# EAGLE design VCF-LP-BP-HP_v4 (EAGLE 9.5.2)
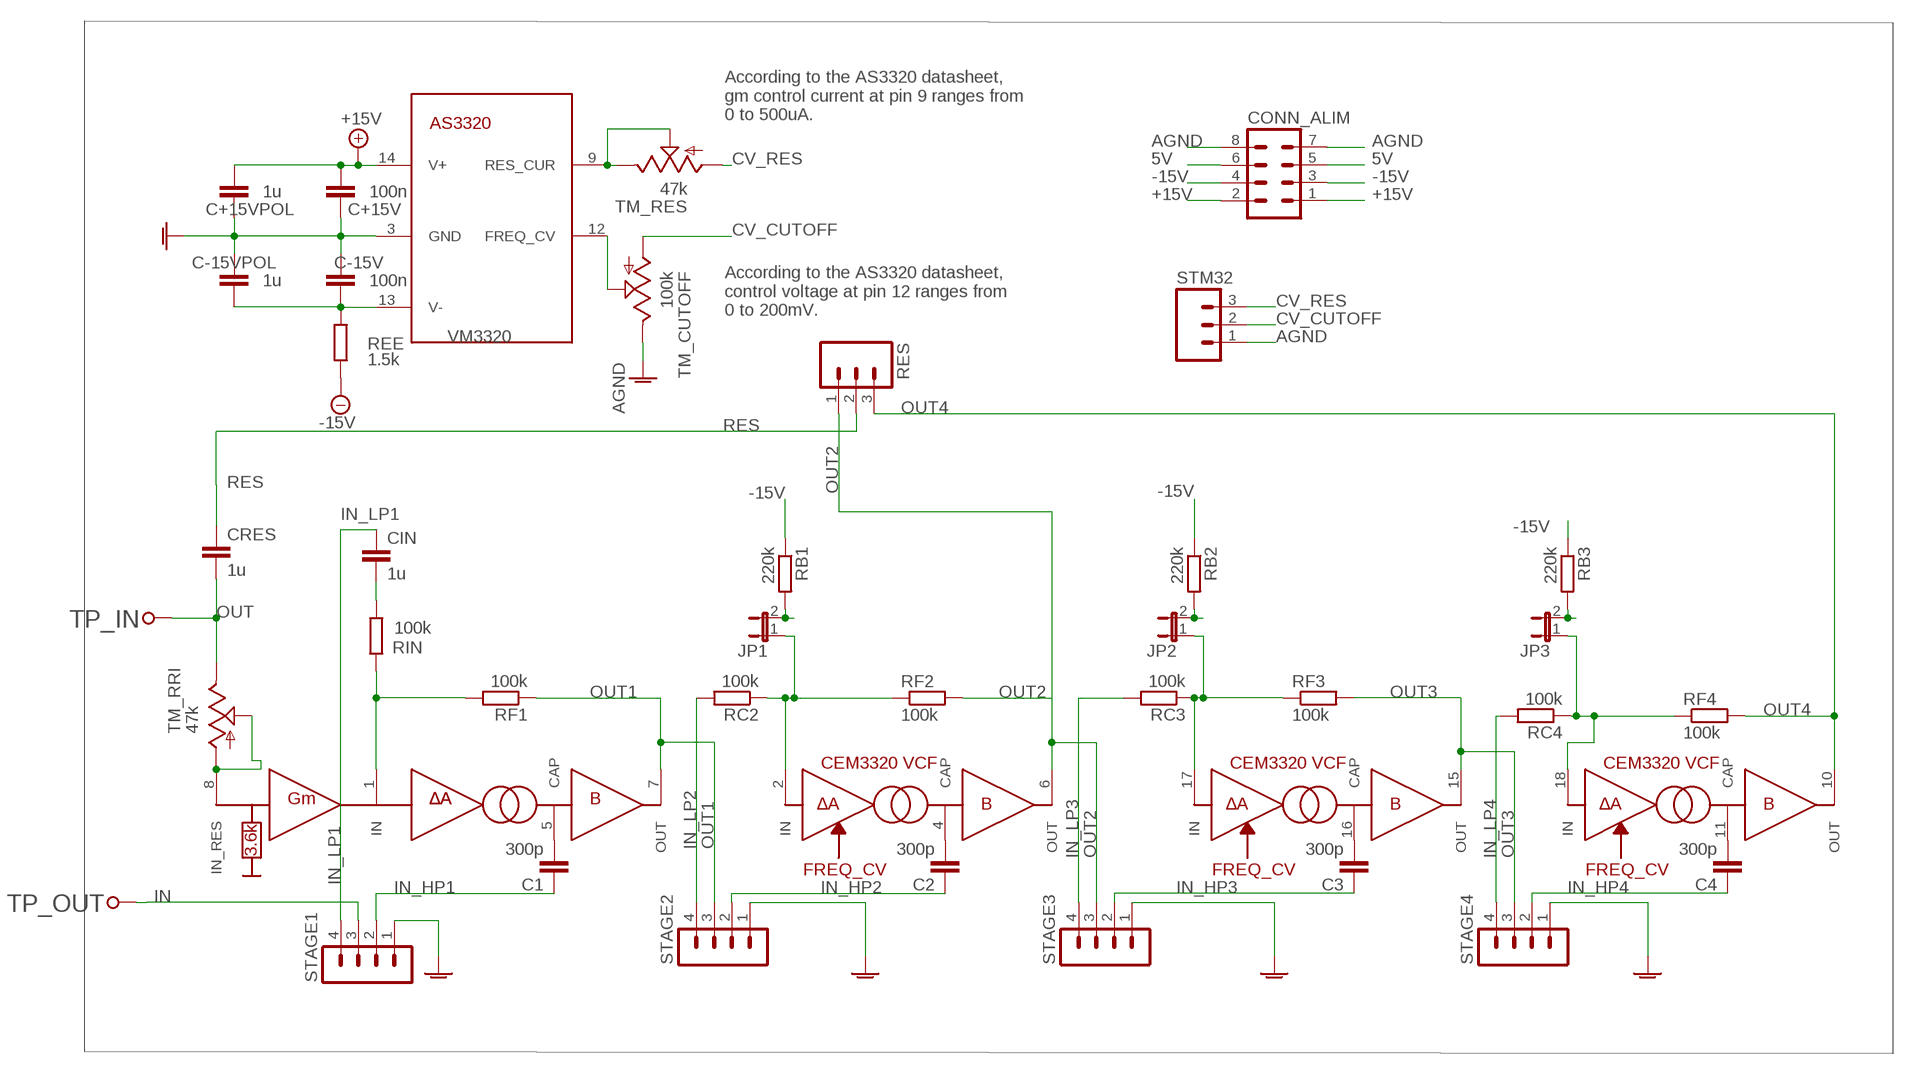
[diagram p0: schematic, sheet 1]

## Parts
C1  300p  C-EU050-030X075  [C050-030X075]
C2  300p  C-EU075-032X103  [C075-032X103]
C3  300p  C-EU050-030X075  [C050-030X075]
C4  300p  C-EU050-030X075  [C050-030X075]
C+15V  100n  C-EU050-050X075  [C050-050X075]
C+15VPOL  1u  C-EU050-050X075  [C050-050X075]
C-15V  100n  C-EU050-050X075  [C050-050X075]
C-15VPOL  1u  C-EU050-050X075  [C050-050X075]
CIN  1u  C-EU050-030X075  [C050-030X075]
CONN_ALIM  MA04-2  [MA04-2]
CRES  1u  C-EU050-030X075  [C050-030X075]
JP1  JP1E  [JP1]
JP2  JP1E  [JP1]
JP3  JP1E  [JP1]
RB1  220k  R-EU_0204/7  [0204/7]
RB2  220k  R-EU_0204/7  [0204/7]
RB3  220k  R-EU_0204/7  [0204/7]
RC2  100k  R-EU_0204/7  [0204/7]
RC3  100k  R-EU_0204/7  [0204/7]
RC4  100k  R-EU_0204/7  [0204/7]
REE  1.5k  R-EU_0207/7  [0207/7]
RES  MA03  [03P]
RF1  100k  R-EU_0204/7  [0204/7]
RF2  100k  R-EU_0204/7  [0204/7]
RF3  100k  R-EU_0204/7  [0204/7]
RF4  100k  R-EU_0204/7  [0204/7]
RIN  100k  R-EU_0204/7  [0204/7]
STAGE1  MA04-1  [MA04-1]
STAGE2  MA04-1  [MA04-1]
STAGE3  MA04-1  [MA04-1]
STAGE4  MA04-1  [MA04-1]
STM32  MA03  [03P]
TM_CUTOFF  100k  TRIM  [6MM]
TM_RES  47k  TRIM  [6MM]
TM_RRI  47k  TRIM  [6MM]
TP_IN  TESTPOINT  [TESTPOINT_63]
TP_OUT  TESTPOINT  [TESTPOINT_63]
VCF  AS3320  [DIL18]

## Nets
5V: CONN_ALIM.5 CONN_ALIM.6
+15V: C+15V.2 C+15VPOL.2 CONN_ALIM.1 CONN_ALIM.2 VCF.14(POW$1:V+)
-15V: CONN_ALIM.3 CONN_ALIM.4 RB1.1 RB2.1 RB3.1 REE.1
AGND: C+15V.1 C+15VPOL.1 C-15V.2 C-15VPOL.2 CONN_ALIM.7 CONN_ALIM.8 STAGE1.1 STAGE2.1 STAGE3.1 STAGE4.1 STM32.1 TM_CUTOFF.E VCF.3(POW$1:GND)
CV_CUTOFF: STM32.2 TM_CUTOFF.A
CV_RES: STM32.3 TM_RES.A
IN: STAGE1.3 TP_OUT.P$1
IN_HP1: C1.1 STAGE1.2
IN_HP2: C2.1 STAGE2.2
IN_HP3: C3.1 STAGE3.2
IN_HP4: C4.1 STAGE4.2
IN_LP1: CIN.1 STAGE1.4
IN_LP2: RC2.2 STAGE2.4
IN_LP3: RC3.2 STAGE3.4
IN_LP4: RC4.2 STAGE4.4
N$1: C3.2 VCF.16(OTA$4:CAP)
N$5: C1.2 VCF.5(OTA$1:CAP)
N$7: JP1.2 RB1.2
N$9: JP2.2 RB2.2
N$10: JP3.2 RB3.2
N$15: JP3.1 RC4.1 RF4.1 VCF.18(OTA$3:IN)
N$17: CIN.2 RIN.1
N$18: C2.2 VCF.4(OTA$2:CAP)
N$24: C4.2 VCF.11(OTA$3:CAP)
N$37: TM_CUTOFF.S VCF.12(POW$1:FREQ_CV)
N$62: JP1.1 RC2.1 RF2.1 VCF.2(OTA$2:IN)
N$72: JP2.1 RC3.1 RF3.1 VCF.17(OTA$4:IN)
N$86: TM_RRI.A TM_RRI.S VCF.8(OTA$1:IN_RES)
N$87: TM_RES.E TM_RES.S VCF.9(POW$1:RES_CUR)
OUT: CRES.2 TM_RRI.E TP_IN.P$1
OUT1: RF1.1 STAGE2.3 VCF.7(OTA$1:OUT)
OUT2: RES.1 RF2.2 STAGE3.3 VCF.6(OTA$2:OUT)
OUT3: RF3.2 STAGE4.3 VCF.15(OTA$4:OUT)
OUT4: RES.3 RF4.2 VCF.10(OTA$3:OUT)
RES: CRES.1 RES.2
VCF_IN: RF1.2 RIN.2 VCF.1(OTA$1:IN)
VM3320: C-15V.1 C-15VPOL.1 REE.2 VCF.13(POW$1:V-)

## Notes on the sheet
- According to the AS3320 datasheet, 
  gm control current at pin 9 ranges from
  0 to 500uA.
- According to the AS3320 datasheet, 
  control voltage at pin 12 ranges from
  0 to 200mV.

## Library data of the parts
C1-C4 C+15V C+15VPOL C-15V C-15VPOL CIN CRES = rcl:C-EU: CAPACITOR, European symbol; SPICEPREFIX: C
CONN_ALIM = con-lstb:MA04-2: PIN HEADER; OC_FARNELL: unknown; OC_NEWARK: unknown
JP1-JP3 = jumper:JP1E: JUMPER
RB1-RB3 RC2-RC4 REE RF1-RF4 RIN = rcl:R-EU_: RESISTOR, European symbol; SPICEPREFIX: R
RES STM32 = con-amp-quick:MA03: AMP QUICK CONNECTOR; OC_FARNELL: unknown; OC_NEWARK: unknown
STAGE1-STAGE4 = con-lstb:MA04-1: PIN HEADER; OC_FARNELL: unknown; OC_NEWARK: unknown
TM_CUTOFF TM_RES TM_RRI = adafruit:TRIM
TP_IN TP_OUT = 6P1_EVB:TESTPOINT
VCF = analog-audio-chips:AS3320: Voltage Controlled Filter capable of 4th order LP, BP or HP designed by famous audio chips designer Curtis Electronics.

## Board
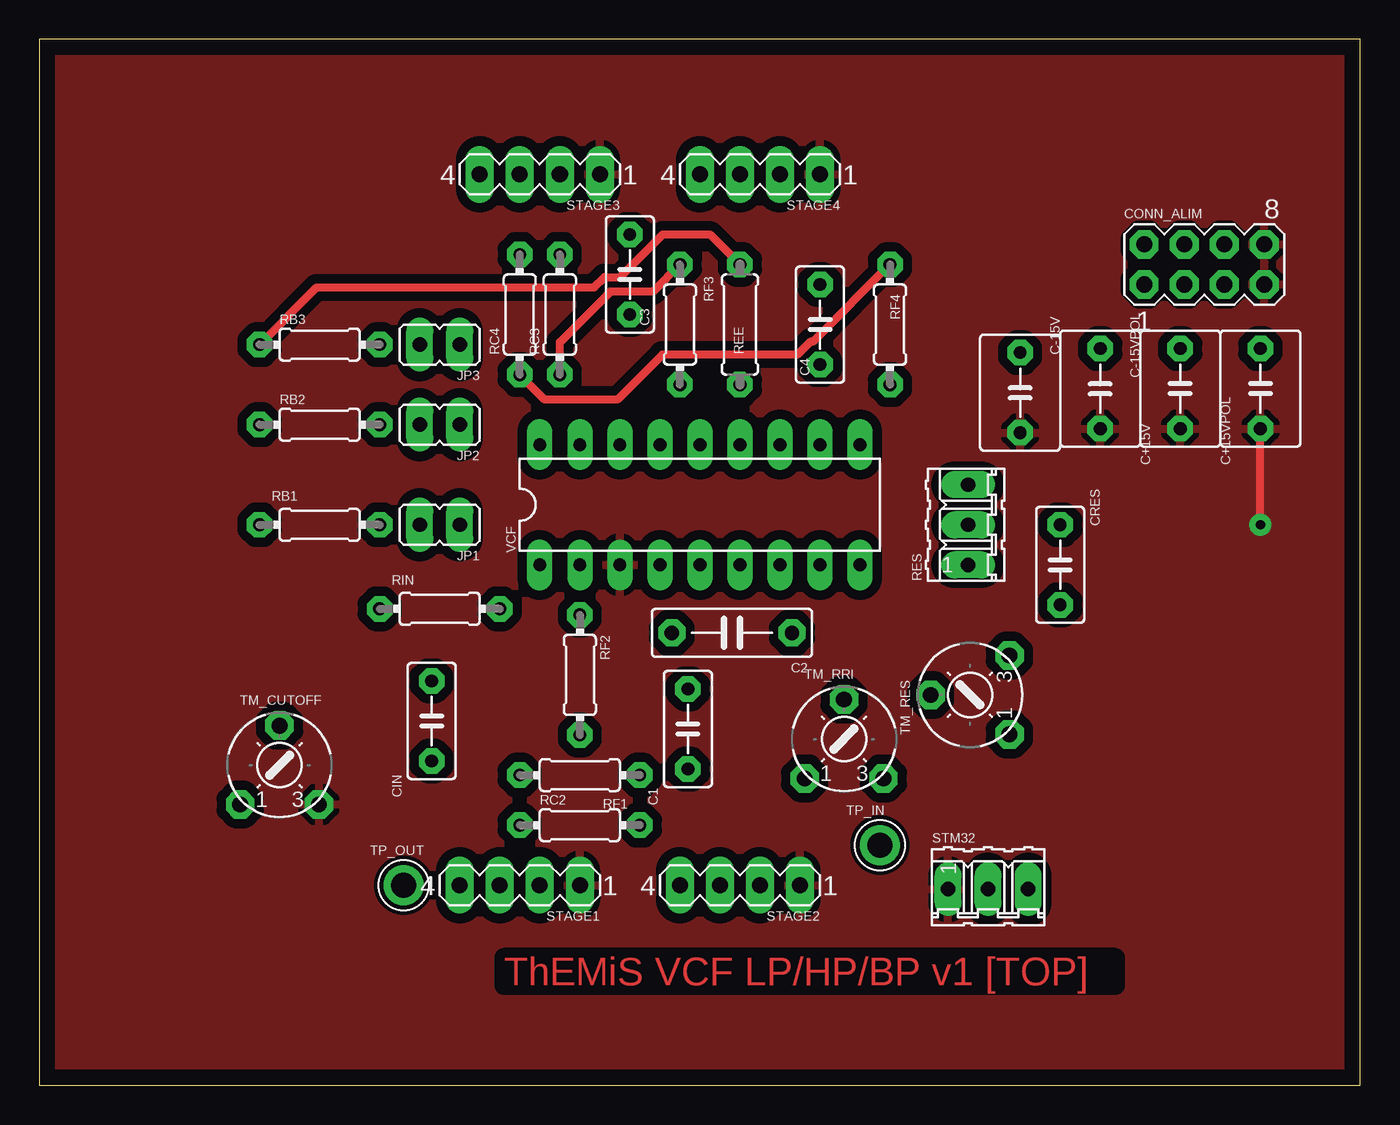
[diagram p1: board, top side]
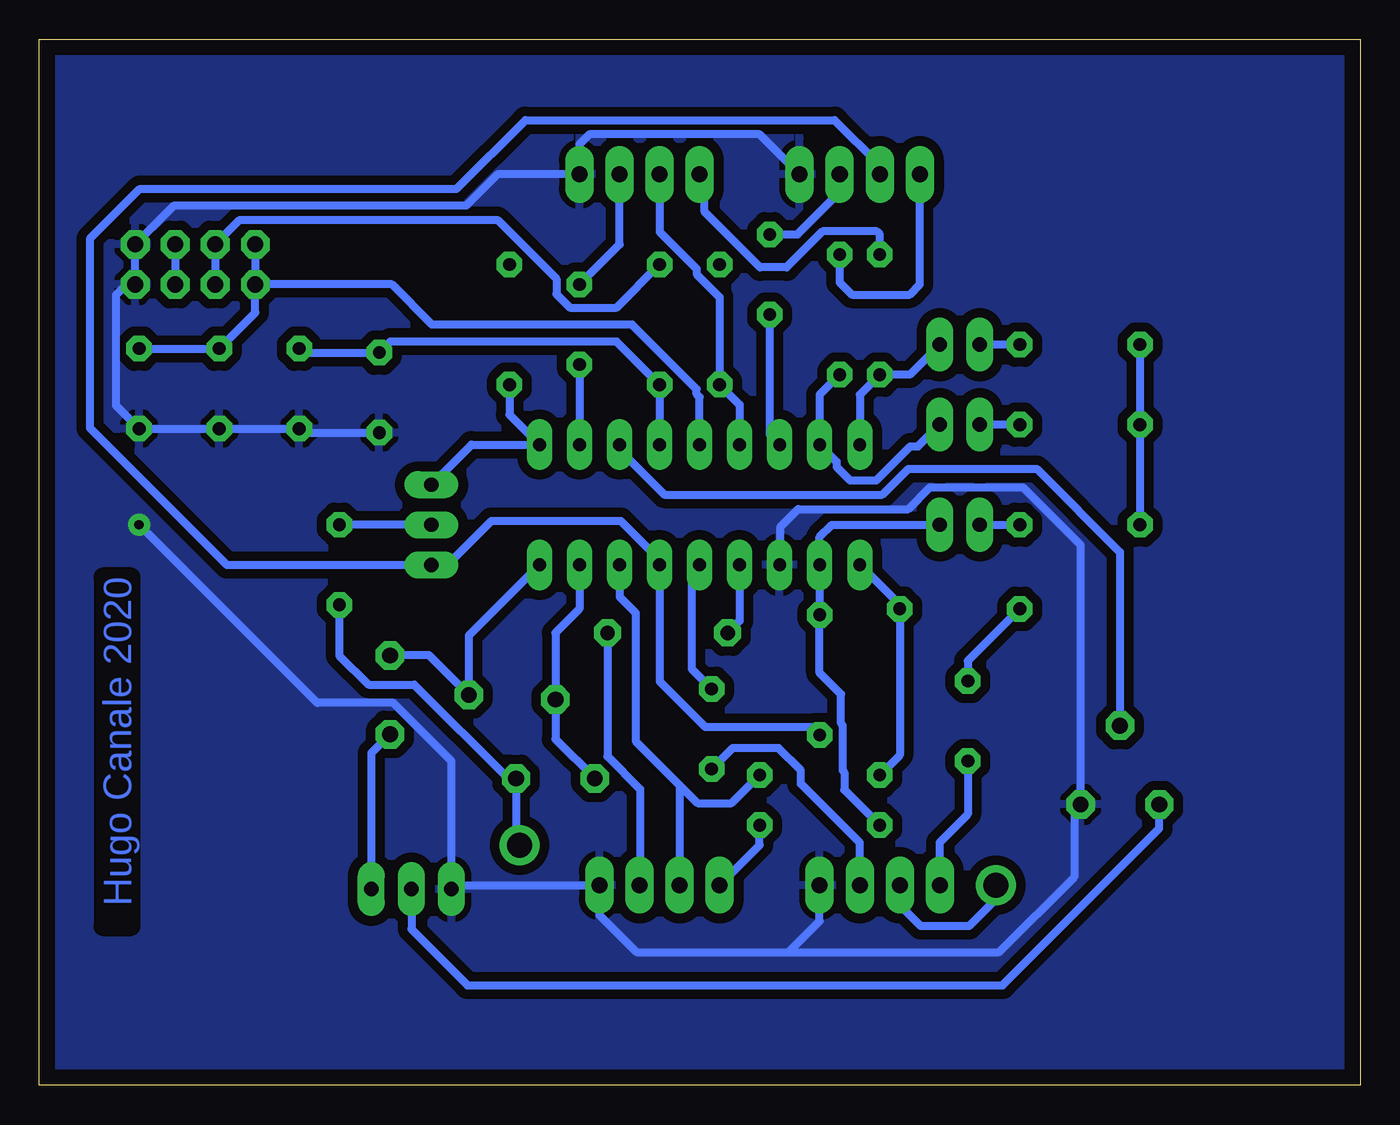
[diagram p2: board, bottom side, seen from below]

Size 83.8 x 66.34 mm. Coordinates in mm from the lower left corner, seen from the top.
Outline: 0,0 83.8,0 83.8,66.34 0,66.34 0,0
Copper layers (1*16): Top 0.035mm / dielectric 1.5mm / Bottom 0.035mm
Design rules "ENSEA_2019": minimum track width 0.4mm, minimum drill 0.6mm, track to track 0.4mm, track to pad 0.4mm, pad to pad 0.4mm, via to via 0.4mm, smd to smd 0.4mm, copper to edge 1mm, drill to drill 0.4mm, minimum pad ring 0.4mm, minimum via ring 0.4mm, stop-mask expansion 4mil, vias tented up to drill 0mil, thermal gap 0.4mm

### Footprints (pad centres in the part's own frame; a part is rotated, then mirrored left to right if it is on the bottom)
C050-030X075 = drill 0.813 octagon: 1 -2.54,0; 2 2.54,0
C075-032X103 = drill 0.914 octagon: 1 -3.81,0; 2 3.81,0
C050-050X075 = drill 0.813 octagon: 1 -2.54,0; 2 2.54,0
MA04-2 = drill 1.016 octagon: 1 -3.81,-1.27; 2 -3.81,1.27; 3 -1.27,-1.27; 4 -1.27,1.27; 5 1.27,-1.27; 6 1.27,1.27; 7 3.81,-1.27; 8 3.81,1.27
JP1 = drill 0.914 long: 1 0,-1.27; 2 0,1.27
0204/7 = drill 0.813 octagon: 1 -3.81,0; 2 3.81,0
0207/7 = drill 0.813 octagon: 1 -3.81,0; 2 3.81,0
03P = drill 0.914 long: 1 -2.54,0; 2 0,0; 3 2.54,0
MA04-1 = drill 1.016 long: 1 -3.81,0; 2 -1.27,0; 3 1.27,0; 4 3.81,0
6MM = drill 1 pad 1.676 octagon: A -2.5,-2.5; E 2.5,-2.5; S 0,2.5
TESTPOINT_63 = drill 1.6 pad 2.54: P$1 0,0
DIL18 = drill 0.813 long: 1 -10.16,-3.81; 2 -7.62,-3.81; 3 -5.08,-3.81; 4 -2.54,-3.81; 5 0,-3.81; 6 2.54,-3.81; 7 5.08,-3.81; 8 7.62,-3.81; 9 10.16,-3.81; 10 10.16,3.81; 11 7.62,3.81; 12 5.08,3.81; 13 2.54,3.81; 14 0,3.81; 15 -2.54,3.81; 16 -5.08,3.81; 17 -7.62,3.81; 18 -10.16,3.81

### Placement (x,y rotation side)
C1  41.15,22.61 90 top
C2  43.94,28.7 180 top
C3  37.47,51.44 270 top
C4  49.53,48.26 270 top
C+15V  72.39,44.2 90 top
C+15VPOL  77.47,44.2 90 top
C-15V  62.23,43.94 270 top
C-15VPOL  67.31,44.2 270 top
CIN  24.89,23.11 90 top
CONN_ALIM  73.91,52.07 0 top
CRES  64.77,33.02 270 top
JP1  25.4,35.56 90 top
JP2  25.4,41.91 90 top
JP3  25.4,46.99 90 top
RB1  17.78,35.56 0 top
RB2  17.78,41.91 0 top
RB3  17.78,46.99 0 top
RC2  34.29,16.51 0 top
RC3  33.02,48.9 90 top
RC4  30.48,48.9 90 top
REE  44.45,48.26 270 top
RES  58.93,35.56 90 top
RF1  34.29,19.68 180 top
RF2  34.29,26.04 270 top
RF3  40.64,48.26 270 top
RF4  53.98,48.26 270 top
RIN  25.4,30.23 0 top
STAGE1  30.48,12.7 180 top
STAGE2  44.45,12.7 180 top
STAGE3  31.75,57.78 180 top
STAGE4  45.72,57.78 180 top
STM32  60.2,12.45 0 top
TM_CUTOFF  15.24,20.32 0 top
TM_RES  59.05,24.77 90 top
TM_RRI  51.05,21.97 0 top
TP_IN  53.34,15.24 0 top
TP_OUT  23.11,12.7 0 top
VCF  41.91,36.83 0 top

### Tracks (layer width: path | path; a pad name or v marks a point on that pad's centre or on a via)
5V
  Bottom 0.508: CONN_ALIM.6 CONN_ALIM.5
+15V
  Bottom 0.508: C+15VPOL.2 C+15V.2 70.1,49.02 CONN_ALIM.1 | CONN_ALIM.2 CONN_ALIM.1 | VCF.14 41.91,43.66 42.1,43.84 42.1,44.17 46.2,48.26 58.9,48.26 61.44,50.8 CONN_ALIM.1
-15V
  Top 0.508: RB3.1 17.59,50.61 35.2,50.61 35.85,51.26 36.85,51.26 39.56,53.98 42.55,53.98 REE.1
  Bottom 0.508: RB3.1 RB2.1 RB1.1 | CONN_ALIM.3 CONN_ALIM.4 71.08,54.9 54.74,54.9 50.99,51.15 50.99,50.2 50.13,49.34 47.18,49.34 REE.1
AGND  (via drill 0.6)
  Top 0.508: v77.47,35.56 C+15VPOL.1
  Bottom 0.508: 36.26,8.45 34.29,10.41 STAGE1.1 | 36.26,8.45 22.9,8.45 18.14,13.21 18.14,17.42 TM_CUTOFF.E 17.74,34.28 21.39,37.93 27.3,37.93 28.67,36.56 35.66,36.56 36.77,35.45 36.77,33.08 VCF.3 | 36.26,8.45 45.91,8.45 48.26,10.79 STAGE2.1 57.4,12.7 STM32.1 57.66,20.57 61.35,24.26 66.17,24.26 v77.47,35.56 | C-15V.2 67.06,41.4 C-15VPOL.2 C+15V.1 C+15VPOL.1 78.93,43.12 78.93,50.13 78.27,50.8 CONN_ALIM.7 CONN_ALIM.8 75.24,55.82 56.7,55.82 54.74,57.78 STAGE4.1 49.53,59.69 48.9,60.33 38.1,60.33 STAGE3.1
  pour Top (isolate 0.61): 0,66.42 84.07,66.42 84.07,0.25 0,0.25
  pour Bottom (isolate 0.61): 0.25,66.42 84.33,66.42 84.33,0.76 83.82,0.25 0.51,0.25 0.25,0
CV_CUTOFF
  Bottom 0.508: STM32.2 60.2,9.91 56.64,6.35 22.69,6.35 12.74,16.3 TM_CUTOFF.A
CV_RES
  Bottom 0.508: TM_RES.A 62.74,21.08 STM32.3
IN
  Bottom 0.508: STAGE1.3 29.21,11.43 27.89,10.12 24.8,10.12 23.11,11.81 TP_OUT.P$1
IN_HP1
  Bottom 0.508: C1.1 39.81,21.4 36.89,21.4 35.48,19.99 35.48,19.13 31.75,15.4 STAGE1.2
IN_HP2
  Bottom 0.508: C2.1 47.75,20.87 45.68,18.8 45.68,12.74 STAGE2.2
IN_HP3
  Bottom 0.508: STAGE3.2 33.02,56.64 35.69,53.98 C3.1
IN_HP4
  Bottom 0.508: C4.1 46.99,53.34 STAGE4.2
IN_LP1
  Bottom 0.508: STAGE1.4 26.67,15.42 24.89,17.2 CIN.1
IN_LP2
  Bottom 0.508: STAGE2.4 38.1,15.24 RC2.2
IN_LP3
  Bottom 0.508: RC3.2 33.02,50.93 32.26,50.16 28.57,50.16 27.94,50.8 STAGE3.4
IN_LP4
  Bottom 0.508: STAGE4.4 41.59,57.47 41.59,55.4 38.07,51.88 36.38,51.88 34.1,54.16 30.67,54.16 30.48,53.98 RC4.2
N$1
  Bottom 0.508: C3.2 37.47,41.27 VCF.16
N$5
  Bottom 0.508: VCF.5 42.42,32.51 42.42,26.42 C1.2
N$7
  Bottom 0.508: JP1.2 RB1.2
N$9
  Bottom 0.508: RB2.2 JP2.2
N$10
  Bottom 0.508: RB3.2 JP3.2
N$15
  Top 0.508: RF4.1 49.09,47.18 48.92,47.18 48.1,46.35 39.53,46.35 36.67,43.5 32.07,43.5 RC4.1
  Bottom 0.508: VCF.18 31.75,43.81 RC4.1 28.57,45.09 JP3.1
N$17
  Bottom 0.508: RIN.1 24.89,26.92 CIN.2
N$18
  Bottom 0.508: VCF.4 39.37,29.46 C2.2
N$24
  Bottom 0.508: C4.2 VCF.11
N$37
  Bottom 0.508: VCF.12 46.99,40.31 44.15,37.47 30.31,37.47 28.67,39.11 20.52,39.11 15.24,33.83 TM_CUTOFF.S
N$62
  Bottom 0.508: JP1.1 33.51,35.56 34.29,34.78 VCF.2 RF2.1 34.29,26.16 32.94,24.81 32.94,22.94 32.83,22.83 32.83,19.97 32.72,19.86 32.72,18.75 RC2.1
N$72
  Top 0.508: RF3.1 38.92,50.35 36.23,50.35 33.02,47.15 RC3.1
  Bottom 0.508: RC3.1 34.29,43.81 VCF.17 33.21,39.56 33.21,39.23 32.35,38.37 30.69,38.37 28.54,40.52 28.06,40.52 JP2.1
N$86
  Bottom 0.508: VCF.8 49.53,30.23 51.05,28.7 TM_RRI.S 51.05,21.97 TM_RRI.A
N$87
  Bottom 0.508: TM_RES.E 61.52,27.3 59.09,27.3 TM_RES.S 56.55,28.54 VCF.9
OUT
  Bottom 0.508: TP_IN.P$1 53.55,15.45 TM_RRI.E 54.06,19.47 60.01,25.42 62.92,25.42 64.77,27.27 CRES.2
OUT1
  Bottom 0.508: VCF.7 46.99,30.99 45.97,29.97 45.97,21.84 43.18,19.05 | 43.18,19.05 42.04,17.91 39.88,17.91 RF1.1 | 43.18,19.05 STAGE2.3
OUT2
  Bottom 0.508: RF2.2 34.8,22.73 41.56,22.73 44.45,25.62 VCF.6 44.45,33.35 46.91,35.81 55.12,35.81 57.91,33.02 RES.1 71.92,33.02 80.6,41.7 80.6,53.69 77.43,56.86 57.33,56.86 52.96,61.23 33.35,61.23 30.48,58.36 STAGE3.3
OUT3
  Bottom 0.508: VCF.15 39.37,43.18 RF3.2 40.64,50.01 42.1,51.47 42.1,51.79 44.45,54.13 STAGE4.3
OUT4
  Bottom 0.508: RF4.2 53.98,42.55 VCF.10 56.39,40.64 RES.3
RES
  Bottom 0.508: RES.2 CRES.1
VCF_IN
  Bottom 0.508: VCF.1 29.21,30.48 RIN.2 29.21,20.95 RF1.2
VM3320
  Bottom 0.508: VCF.13 REE.2 47.18,47.18 61.53,47.18 C-15V.1 67.06,46.48 C-15VPOL.1

### Text on the board
Top: ThEMiS VCF LP/HP/BP v1 [TOP]
Bottom: Hugo Canale 2020